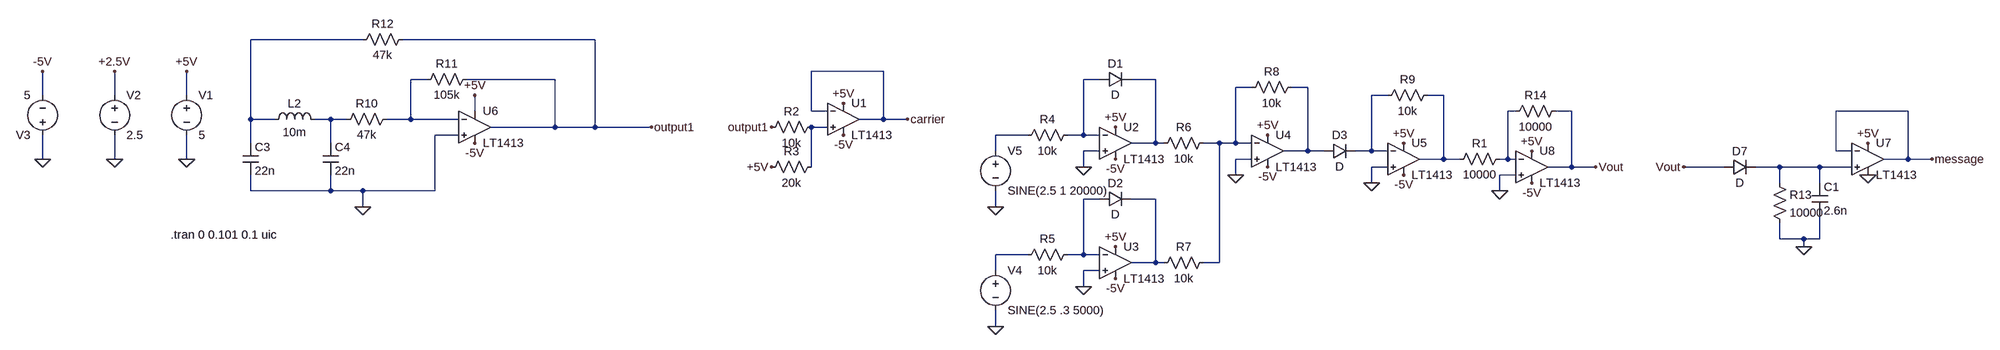
[diagram p0: schematic colpitts.asc]
colpitts.asc, the LTspice schematic file:
Version 4
SHEET 1 3432 2420
WIRE -80 880 -304 880
WIRE 384 880 0 880
WIRE 976 944 832 944
WIRE 48 960 16 960
WIRE 304 960 128 960
WIRE 1408 960 1376 960
WIRE 1520 960 1472 960
WIRE 1712 976 1680 976
WIRE 1824 976 1792 976
WIRE -720 992 -720 944
WIRE -576 992 -576 944
WIRE -432 992 -432 944
WIRE 1984 992 1952 992
WIRE 2096 992 2064 992
WIRE 144 1024 144 992
WIRE 832 1024 832 944
WIRE 864 1024 832 1024
WIRE 2240 1024 2224 1024
WIRE 2352 1024 2320 1024
WIRE 3024 1024 2880 1024
WIRE -304 1040 -304 880
WIRE -256 1040 -304 1040
WIRE -144 1040 -176 1040
WIRE -112 1040 -144 1040
WIRE 16 1040 16 960
WIRE 16 1040 -32 1040
WIRE 112 1040 16 1040
WIRE 976 1040 976 944
WIRE 976 1040 928 1040
WIRE 1024 1040 976 1040
WIRE 304 1056 304 960
WIRE 304 1056 176 1056
WIRE 384 1056 384 880
WIRE 384 1056 304 1056
WIRE 512 1056 384 1056
WIRE 864 1056 832 1056
WIRE 112 1072 64 1072
WIRE 1264 1072 1200 1072
WIRE 1376 1072 1376 960
WIRE 1376 1072 1344 1072
WIRE 1408 1072 1376 1072
WIRE -304 1088 -304 1040
WIRE -144 1088 -144 1040
WIRE 1520 1088 1520 960
WIRE 1520 1088 1472 1088
WIRE 1536 1088 1520 1088
WIRE 1648 1088 1616 1088
WIRE 1680 1088 1680 976
WIRE 1680 1088 1648 1088
WIRE 1712 1088 1680 1088
WIRE 1200 1104 1200 1072
WIRE 1408 1104 1376 1104
WIRE 1824 1104 1824 976
WIRE 1824 1104 1776 1104
WIRE 1856 1104 1824 1104
WIRE 1952 1104 1952 992
WIRE 1952 1104 1920 1104
WIRE 1984 1104 1952 1104
WIRE 2880 1104 2880 1024
WIRE 2912 1104 2880 1104
WIRE -720 1120 -720 1072
WIRE -576 1120 -576 1072
WIRE -432 1120 -432 1072
WIRE 1712 1120 1680 1120
WIRE 2096 1120 2096 992
WIRE 2096 1120 2048 1120
WIRE 2128 1120 2096 1120
WIRE 2224 1120 2224 1024
WIRE 2224 1120 2208 1120
WIRE 2240 1120 2224 1120
WIRE 3024 1120 3024 1024
WIRE 3024 1120 2976 1120
WIRE 3072 1120 3024 1120
WIRE 832 1136 832 1056
WIRE 1376 1136 1376 1104
WIRE 1984 1136 1952 1136
WIRE 2352 1136 2352 1024
WIRE 2352 1136 2304 1136
WIRE 2400 1136 2352 1136
WIRE 2656 1136 2576 1136
WIRE 2768 1136 2720 1136
WIRE 2848 1136 2768 1136
WIRE 2912 1136 2848 1136
WIRE 1680 1152 1680 1120
WIRE 2240 1152 2208 1152
WIRE 1952 1168 1952 1136
WIRE 2768 1168 2768 1136
WIRE 2848 1168 2848 1136
WIRE -304 1184 -304 1152
WIRE -144 1184 -144 1152
WIRE -144 1184 -304 1184
WIRE -80 1184 -144 1184
WIRE 64 1184 64 1072
WIRE 64 1184 -80 1184
WIRE 2208 1184 2208 1152
WIRE 1408 1200 1376 1200
WIRE 1520 1200 1472 1200
WIRE -80 1216 -80 1184
WIRE 1200 1216 1200 1184
WIRE 2768 1280 2768 1248
WIRE 2816 1280 2768 1280
WIRE 2848 1280 2848 1232
WIRE 2848 1280 2816 1280
WIRE 2816 1296 2816 1280
WIRE 1264 1312 1200 1312
WIRE 1376 1312 1376 1200
WIRE 1376 1312 1344 1312
WIRE 1408 1312 1376 1312
WIRE 1520 1328 1520 1200
WIRE 1520 1328 1472 1328
WIRE 1536 1328 1520 1328
WIRE 1648 1328 1648 1088
WIRE 1648 1328 1616 1328
WIRE 1200 1344 1200 1312
WIRE 1408 1344 1376 1344
WIRE 1376 1376 1376 1344
WIRE 1200 1456 1200 1424
FLAG -432 1120 0
FLAG -576 1120 0
FLAG -576 944 +2.5V
FLAG -432 944 +5V
FLAG 1440 1056 +5V
FLAG 1440 1296 +5V
FLAG 1744 1072 +5V
FLAG 2016 1088 +5V
FLAG 512 1056 output1
FLAG 144 992 +5V
FLAG -80 1216 0
FLAG 1200 1456 0
FLAG 2576 1136 Vout
FLAG 896 1008 +5V
FLAG 752 1056 output1
FLAG 1024 1040 carrier
FLAG 2944 1088 +5V
FLAG 2944 1152 0
FLAG 3072 1120 message
FLAG -720 944 -5V
FLAG -720 1120 0
FLAG 144 1088 -5V
FLAG 896 1072 -5V
FLAG 1440 1120 -5V
FLAG 1440 1360 -5V
FLAG 1744 1136 -5V
FLAG 2016 1152 -5V
FLAG 1376 1136 0
FLAG 1376 1376 0
FLAG 1680 1152 0
FLAG 1952 1168 0
FLAG 752 1136 +5V
FLAG 1200 1216 0
FLAG 2816 1296 0
FLAG 2400 1136 Vout
FLAG 2272 1104 +5V
FLAG 2272 1168 -5V
FLAG 2208 1184 0
SYMBOL voltage -432 976 R0
WINDOW 123 0 0 Left 0
WINDOW 39 0 0 Left 0
SYMATTR InstName V1
SYMATTR Value 5
SYMBOL voltage -576 976 R0
WINDOW 123 0 0 Left 0
WINDOW 39 0 0 Left 0
SYMATTR InstName V2
SYMATTR Value 2.5
SYMBOL Opamps\\LT1413 1440 1024 R0
SYMATTR InstName U2
SYMBOL Opamps\\LT1413 1440 1264 R0
SYMATTR InstName U3
SYMBOL res 1360 1056 R90
WINDOW 0 0 56 VBottom 2
WINDOW 3 32 56 VTop 2
SYMATTR InstName R4
SYMATTR Value 10k
SYMBOL res 1360 1296 R90
WINDOW 0 0 56 VBottom 2
WINDOW 3 32 56 VTop 2
SYMATTR InstName R5
SYMATTR Value 10k
SYMBOL diode 1408 976 R270
WINDOW 0 32 32 VTop 2
WINDOW 3 0 32 VBottom 2
SYMATTR InstName D1
SYMBOL diode 1408 1216 R270
WINDOW 0 32 32 VTop 2
WINDOW 3 0 32 VBottom 2
SYMATTR InstName D2
SYMBOL res 1632 1072 R90
WINDOW 0 0 56 VBottom 2
WINDOW 3 32 56 VTop 2
SYMATTR InstName R6
SYMATTR Value 10k
SYMBOL res 1632 1312 R90
WINDOW 0 0 56 VBottom 2
WINDOW 3 32 56 VTop 2
SYMATTR InstName R7
SYMATTR Value 10k
SYMBOL Opamps\\LT1413 1744 1040 R0
SYMATTR InstName U4
SYMBOL res 1808 960 R90
WINDOW 0 0 56 VBottom 2
WINDOW 3 32 56 VTop 2
SYMATTR InstName R8
SYMATTR Value 10k
SYMBOL diode 1856 1120 R270
WINDOW 0 32 32 VTop 2
WINDOW 3 0 32 VBottom 2
SYMATTR InstName D3
SYMBOL Opamps\\LT1413 2016 1056 R0
SYMATTR InstName U5
SYMBOL res 2080 976 R90
WINDOW 0 0 56 VBottom 2
WINDOW 3 32 56 VTop 2
SYMATTR InstName R9
SYMATTR Value 10k
SYMBOL ind -272 1056 R270
WINDOW 0 32 56 VTop 2
WINDOW 3 5 56 VBottom 2
SYMATTR InstName L2
SYMATTR Value 10m
SYMBOL res -16 1024 R90
WINDOW 0 0 56 VBottom 2
WINDOW 3 32 56 VTop 2
SYMATTR InstName R10
SYMATTR Value 47k
SYMBOL res 144 944 R90
WINDOW 0 0 56 VBottom 2
WINDOW 3 32 56 VTop 2
SYMATTR InstName R11
SYMATTR Value 105k
SYMBOL res 16 864 R90
WINDOW 0 0 56 VBottom 2
WINDOW 3 32 56 VTop 2
SYMATTR InstName R12
SYMATTR Value 47k
SYMBOL cap -320 1088 R0
SYMATTR InstName C3
SYMATTR Value 22n
SYMBOL cap -160 1088 R0
SYMATTR InstName C4
SYMATTR Value 22n
SYMBOL Opamps\\LT1413 144 992 R0
SYMATTR InstName U6
SYMBOL voltage 1200 1328 R0
WINDOW 123 0 0 Left 0
WINDOW 39 0 0 Left 0
SYMATTR InstName V4
SYMATTR Value SINE(2.5 .3 5000)
SYMBOL diode 2656 1152 R270
WINDOW 0 32 32 VTop 2
WINDOW 3 0 32 VBottom 2
SYMATTR InstName D7
SYMBOL Opamps\\LT1413 896 976 R0
SYMATTR InstName U1
SYMBOL Opamps\\LT1413 2944 1056 R0
SYMATTR InstName U7
SYMBOL voltage -720 1088 R180
WINDOW 123 0 0 Left 0
WINDOW 39 0 0 Left 0
SYMATTR InstName V3
SYMATTR Value 5
SYMBOL res 848 1040 R90
WINDOW 0 0 56 VBottom 2
WINDOW 3 32 56 VTop 2
SYMATTR InstName R2
SYMATTR Value 10k
SYMBOL res 848 1120 R90
WINDOW 0 0 56 VBottom 2
WINDOW 3 32 56 VTop 2
SYMATTR InstName R3
SYMATTR Value 20k
SYMBOL voltage 1200 1088 R0
WINDOW 123 0 0 Left 0
WINDOW 39 0 0 Left 0
SYMATTR InstName V5
SYMATTR Value SINE(2.5 1 20000)
SYMBOL res 2752 1152 R0
SYMATTR InstName R13
SYMATTR Value 10000
SYMBOL cap 2832 1168 R0
SYMATTR InstName C1
SYMATTR Value 2.6n
SYMBOL Opamps\\LT1413 2272 1072 R0
SYMATTR InstName U8
SYMBOL res 2224 1104 R90
WINDOW 0 0 56 VBottom 2
WINDOW 3 32 56 VTop 2
SYMATTR InstName R1
SYMATTR Value 10000
SYMBOL res 2336 1008 R90
WINDOW 0 0 56 VBottom 2
WINDOW 3 32 56 VTop 2
SYMATTR InstName R14
SYMATTR Value 10000
TEXT -464 1272 Left 2 !.tran 0 0.101 0.1 uic

The netlist it stands for:
* colpitts.asc
V1 +5V 0 5
V2 +2.5V 0 2.5
XU2 0 N003 +5V -5V N004 LT1413  ; pins In+ In- V+ V- OUT
XU3 0 N014 +5V -5V N015 LT1413  ; pins In+ In- V+ V- OUT
R4 N003 N012 10k
R5 N014 N016 10k
D1 N003 N004 D
D2 N014 N015 D
R6 N005 N004 10k
R7 N005 N015 10k
XU4 0 N005 +5V -5V N006 LT1413  ; pins In+ In- V+ V- OUT
R8 N006 N005 10k
D3 N006 N007 D
XU5 0 N007 +5V -5V N008 LT1413  ; pins In+ In- V+ V- OUT
R9 N008 N007 10k
L2 N001 N010 10m
R10 N002 N010 47k
R11 output1 N002 105k
R12 output1 N001 47k
C3 N001 0 22n
C4 N010 0 22n
XU6 0 N002 +5V -5V output1 LT1413  ; pins In+ In- V+ V- OUT
V4 N016 0 SINE(2.5 .3 5000)
D7 Vout N013 D
XU1 N011 carrier +5V -5V carrier LT1413  ; pins In+ In- V+ V- OUT
XU7 N013 message +5V 0 message LT1413  ; pins In+ In- V+ V- OUT
V3 0 -5V 5
R2 N011 output1 10k
R3 N011 +5V 20k
V5 N012 0 SINE(2.5 1 20000)
R13 N013 0 10000
C1 N013 0 2.6n
XU8 0 N009 +5V -5V Vout LT1413  ; pins In+ In- V+ V- OUT
R1 N009 N008 10000
R14 Vout N009 10000
.model D D
.lib standard.dio
.tran 0 0.101 0.1 uic
.lib LTC.lib
.backanno
.end

* Results of the author's LTspice run, read from the files saved beside the schematic
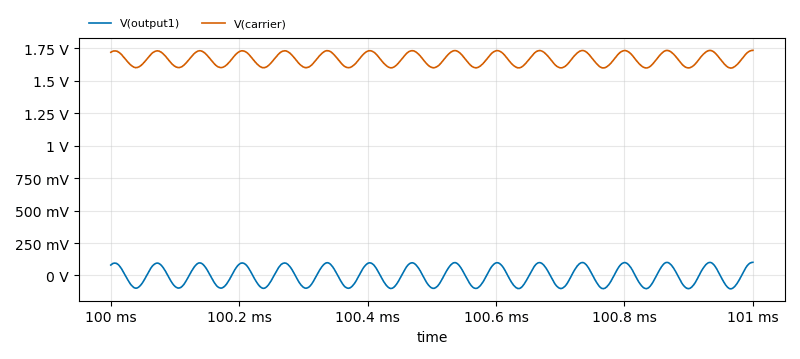
[diagram p1: Transient Analysis of colpitts.asc, plotted from the saved traces]
* Transient Analysis, 1 run:
*   V(output1): min -102.6 mV, max 101.5 mV, average 85.76 µV, rms 70.1 mV, last 101.5 mV
*   V(carrier): min 1.598 V, max 1.735 V, average 1.667 V, rms 1.667 V, last 1.735 V